# EAGLE design PiRFM12 (EAGLE 6.5.0)
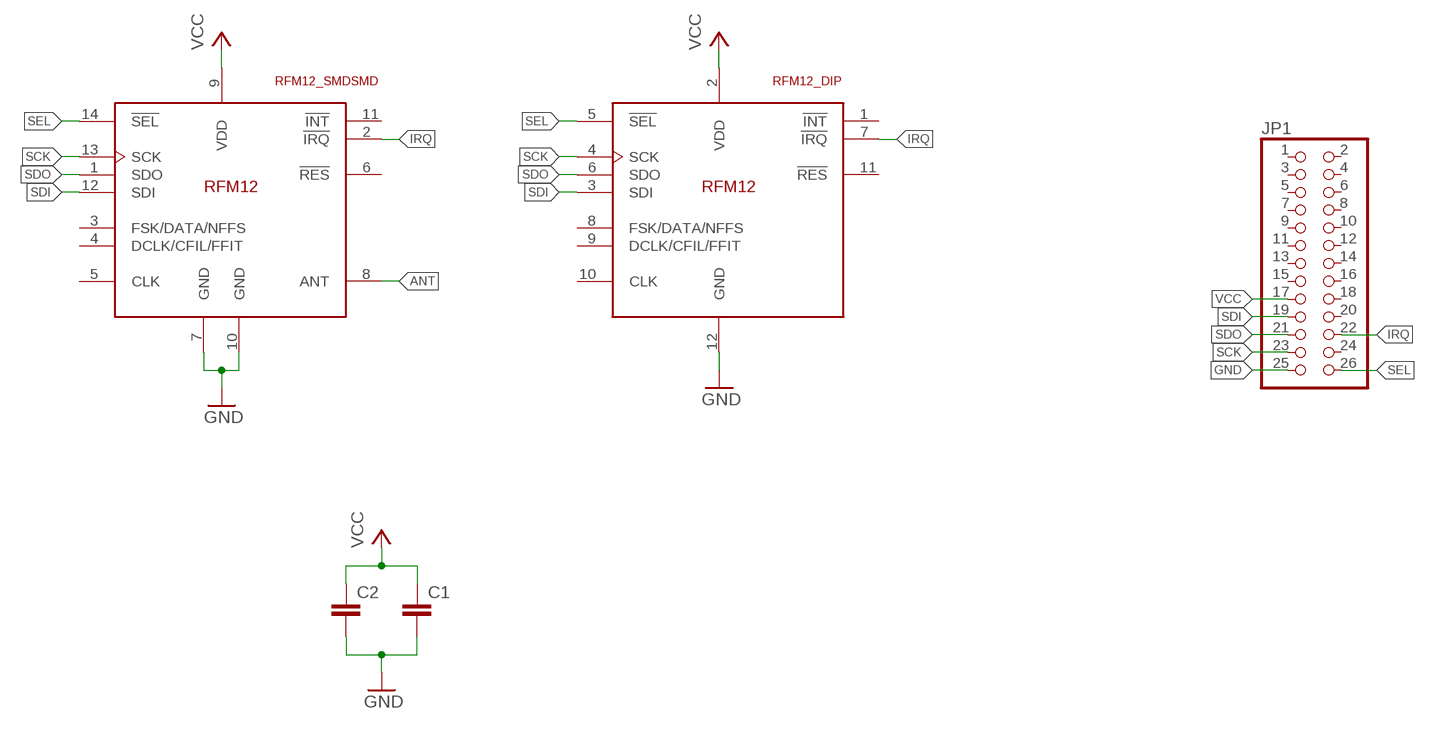
[diagram p0: schematic, sheet 1]

## Parts
C1  C-EUC0805  [C0805]
C2  C-EUC0805  [C0805]
JP1  PINHD-2X13  [2X13]
U$1  RFM12_SMDSMD  [RFM12]
U$2  RFM12_DIP  [DIL-2MM-2X06]

## Nets
ANT: U$1.8(ANT)
GND: C1.2 C2.2 JP1.25 U$1.7(GND) U$1.10(GND) U$2.12(GND)
IRQ: JP1.22 U$1.2(!IRQ) U$2.7(!IRQ)
SCK: JP1.23 U$1.13(SCK) U$2.4(SCK)
SDI: JP1.19 U$1.12(SDI) U$2.3(SDI)
SDO: JP1.21 U$1.1(SDO) U$2.6(SDO)
SEL: JP1.26 U$1.14(!SEL) U$2.5(!SEL)
VCC: C1.1 C2.1 JP1.17 U$1.9(VDD) U$2.2(VDD)
Unconnected: JP1.1 JP1.2 JP1.3 JP1.4 JP1.5 JP1.6 JP1.7 JP1.8 JP1.9 JP1.10 JP1.11 JP1.12 JP1.13 JP1.14 JP1.15 JP1.16 JP1.18 JP1.20 JP1.24 U$1.3(FSK/DATA/NFFS) U$1.4(DCLK/CFIL/FFIT) U$1.5(CLK) U$1.6(!RES) U$1.11(!INT) U$2.1(!INT) U$2.8(FSK/DATA/NFFS) U$2.9(DCLK/CFIL/FFIT) U$2.10(CLK) U$2.11(!RES)

## Library data of the parts
C1 C2 = rcl:C-EU: CAPACITOR, European symbol
JP1 = pinhead:PINHD-2X13: PIN HEADER
U$1 = rfm_12:RFM12_SMD: RFM12 is a low costing ISM band transceiver module implemented with unique PLL. It works signal ranges from 315/433/868/915MHZ bands, comply with FCC, ETSI regulation. The SPI interface is used to communicate with microcontroller for parameter setting.
U$2 = rfm_12:RFM12_DIP: RFM12 is a low costing ISM band transceiver module implemented with unique PLL. It works signal ranges from 315/433/868/915MHZ bands, comply with FCC, ETSI regulation. The SPI interface is used to communicate with microcontroller for parameter setting.

## Board
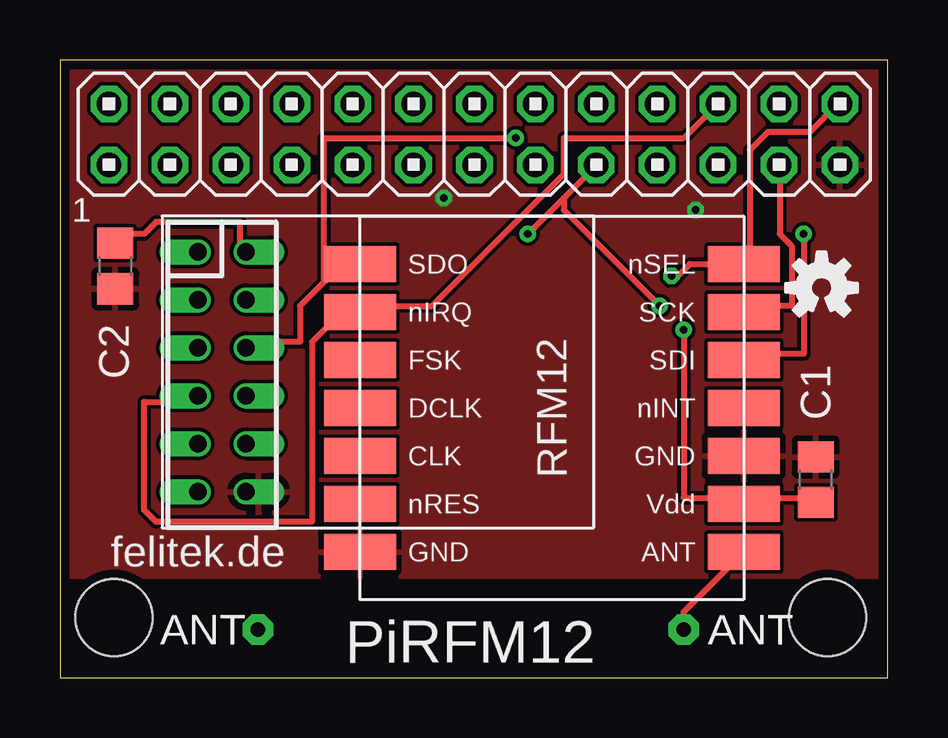
[diagram p1: board, top side]
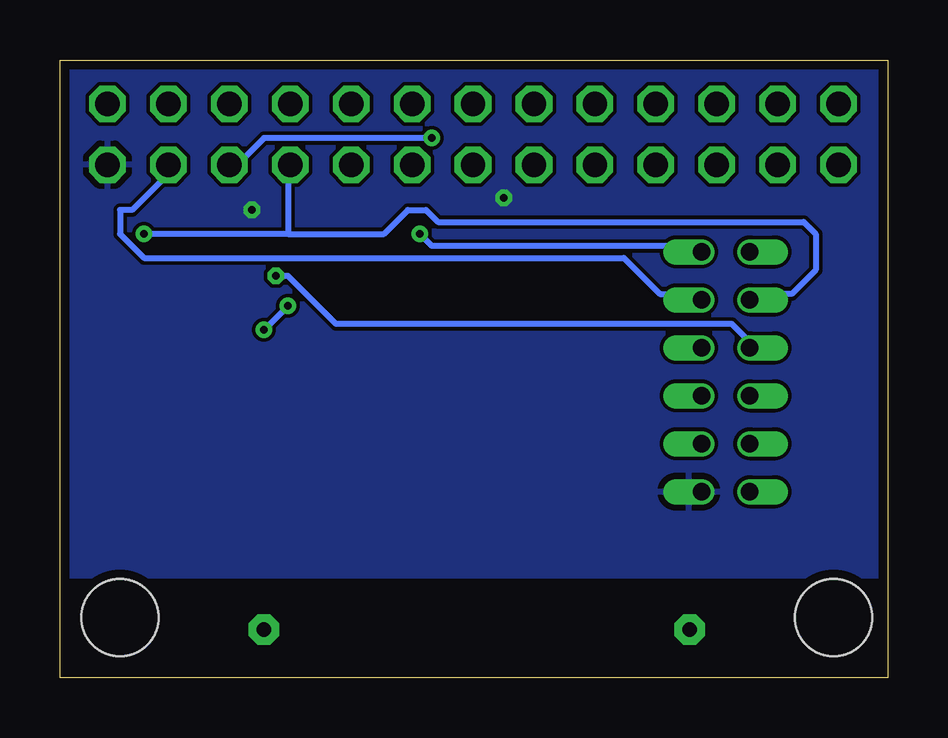
[diagram p2: board, bottom side, seen from below]

Size 34.5 x 25.75 mm. Coordinates in mm from the lower left corner, seen from the top.
Outline: 0,0 34.5,0 34.5,25.75 0,25.75 0,0
Copper layers (1*16): Top 0.0356mm / dielectric 1.5011mm / Bottom 0.0356mm
Design rules "LaenPCBOrder": minimum track width 6mil, minimum drill 13mil, track to track 6mil, track to pad 6mil, pad to pad 6mil, via to via 6mil, smd to smd 6mil, copper to edge 15mil, drill to drill 6mil, minimum pad ring 7mil, minimum via ring 7mil, stop-mask expansion 3mil, vias tented up to drill 0mil, thermal gap 10mil
Holes 3.2 mm at 2.25,2.5 32,2.5

### Footprints (pad centres in the part's own frame; a part is rotated, then mirrored left to right if it is on the bottom)
C0805 = smd 1.3 x 1.5: 1 -0.95,0; 2 0.95,0
2X13 = drill 1.016 octagon: 1 -15.24,-1.27; 2 -15.24,1.27; 3 -12.7,-1.27; 4 -12.7,1.27; 5 -10.16,-1.27; 6 -10.16,1.27; 7 -7.62,-1.27; 8 -7.62,1.27; 9 -5.08,-1.27; 10 -5.08,1.27; 11 -2.54,-1.27; 12 -2.54,1.27; 13 0,-1.27; 14 0,1.27; 15 2.54,-1.27; 16 2.54,1.27; 17 5.08,-1.27; 18 5.08,1.27; 19 7.62,-1.27; 20 7.62,1.27; 21 10.16,-1.27; 22 10.16,1.27; 23 12.7,-1.27; 24 12.7,1.27; 25 15.24,-1.27; 26 15.24,1.27
RFM12 = smd 1.5 x 3: 1 -5,-10; 2 -3,-10; 3 -1,-10; 4 1,-10; 5 3,-10; 6 5,-10; 7 7,-10; 8 7,6; 9 5,6; 10 3,6; 11 1,6; 12 -1,6; 13 -3,6; 14 -5,6
DIL-2MM-2X06 = drill 0.711 offset: 1 -1,5; 2 1,5; 3 -1,3; 4 1,3; 5 -1,1; 6 1,1; 7 -1,-1; 8 1,-1; 9 -1,-3; 10 1,-3; 11 -1,-5; 12 1,-5

### Placement (x,y rotation side)
C1  31.5,8.25 90 top
C2  2.31,17.16 270 top
JP1  17.28,22.65 0 top
U$1  22.5,12.25 270 top
U$2  6.75,12.75 0 top
U$3  [OSHW-LOGO-S]  31.75,16.25 0 top

### Tracks (layer width: path | path; a pad name or v marks a point on that pad's centre or on a via)
ANT  (via drill 0.6 pad 1.27)
  Top 0.254: v26,2 26,2.75 U$1.8
GND  (via drill 0.33)
  other vias: 26.5,19.5 16,20
  pour Top: -0.5,4.25 35,4.25 35,26 -0.5,26
  pour Bottom: -0.5,4.25 35.5,4.25 35.5,26.25 -0.5,26.25
IRQ
  Top 0.254: U$2.7 5.5,11.5 3.5,11.5 3.5,7 4,6.5 10.5,6.5 10.5,14 11.5,15 12.5,15 U$1.2 12.5,15.5 15.5,15.5 21,21 21,22.5 26,22.5 27,23.5 JP1.22
N$1  (via drill 0.6 pad 1.27)
  other vias: 8.25,2
SCK
  Top 0.254: U$1.13 28.5,15.5 30.5,15.5 30.5,18 30,18.5 30,21 JP1.23
  Bottom 0.254: U$2.4 8,16 9.5,16 11,17.5 31,17.5 32,18.5 32,19.5 31.5,19.5 30,21 JP1.23
SDI  (via drill 0.33)
  Top 0.254: v31,18.5 31,13.5 28.5,13.5 U$1.12
  Bottom 0.254: 25,18.5 21,18.5 20,19.5 19.25,19.5 18.75,19 3.5,19 3,18.5 3,17 4,16 5.5,16 U$2.3 | 25,18.5 25,21 JP1.19 | 25,18.5 v31,18.5
SDO  (via drill 0.33)
  Top 0.254: 11,16.5 11.5,17 12.5,17 U$1.1 | 11,16.5 10,15.5 10,14 8,14 U$2.6 | v19,22.5 11,22.5 11,16.5
  Bottom 0.254: v19,22.5 26,22.5 27,21.5 JP1.21
SEL  (via drill 0.33)
  Top 0.254: v25.5,16.75 25.75,16.75 26.25,17.25 28,17.25 | 28,17.25 U$1.14 | JP1.26 32.42,23.92 31.25,22.75 29.5,22.75 28.75,22 28.75,18 28,17.25
  Bottom 0.254: U$2.5 5.75,14 6.5,14.75 23,14.75 25,16.75 v25.5,16.75
VCC  (via drill 0.33)
  Top 0.254: 28.5,7.5 31.5,7.5 C1.1 | C2.1 2.5,18.5 3.5,18.5 4,19 7.5,19 7.5,18 U$2.2 | v19.5,18.5 21,20 | 21,20 22,21 JP1.17 | 28.5,7.5 26,7.5 v26,14.5 | v25,15.5 21,19.5 21,20 | 28.5,7.5 U$1.9
  Bottom 0.254: v19.5,18.5 19,18 8,18 U$2.2 | v25,15.5 v26,14.5

### Text on the board
tNames: 1 | felitek.de | ANT | PiRFM12 | ANT